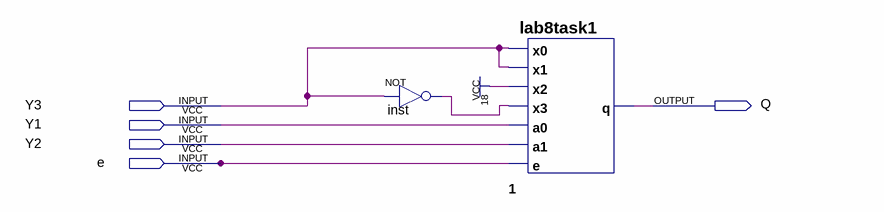
[diagram p0: schematic sheet]
// Quartus schematic lab8task82.bdf as structural Verilog: 2 symbols, 5 pins
module lab8task82 (
  input  Y3,
  input  Y1,
  input  Y2,
  input  e,
  output Q
);

  wire inst_out;

  not inst (inst_out, Y3);
  lab8task1 u_1 (.x0(Y3), .x1(Y3), .x2(1'b1), .x3(inst_out), .a0(Y1), .a1(Y2), .e(e), .q(Q));
endmodule
